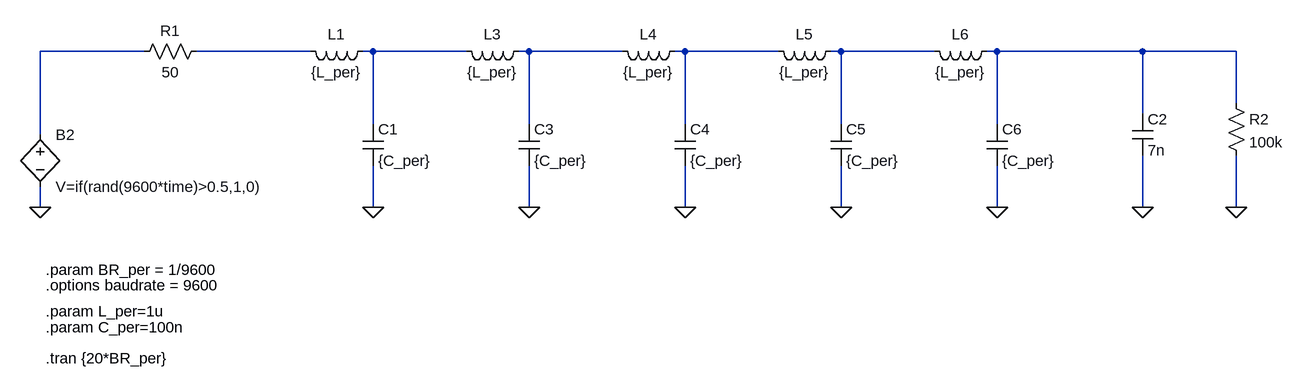
[diagram p0: schematic tline.asc]
tline.asc, the LTspice schematic file:
Version 4
SHEET 1 1784 680
WIRE 32 64 -128 64
WIRE 288 64 112 64
WIRE 384 64 368 64
WIRE 528 64 384 64
WIRE 624 64 608 64
WIRE 768 64 624 64
WIRE 864 64 848 64
WIRE 1008 64 864 64
WIRE 1104 64 1088 64
WIRE 1248 64 1104 64
WIRE 1344 64 1328 64
WIRE 1568 64 1344 64
WIRE 1712 64 1568 64
WIRE 1712 144 1712 64
WIRE 1568 160 1568 64
WIRE 384 176 384 64
WIRE 624 176 624 64
WIRE 864 176 864 64
WIRE 1104 176 1104 64
WIRE 1344 176 1344 64
WIRE -128 192 -128 64
WIRE -128 304 -128 272
WIRE 384 304 384 240
WIRE 624 304 624 240
WIRE 864 304 864 240
WIRE 1104 304 1104 240
WIRE 1344 304 1344 240
WIRE 1568 304 1568 224
WIRE 1712 304 1712 224
FLAG -128 304 0
FLAG 384 304 0
FLAG 624 304 0
FLAG 864 304 0
FLAG 1104 304 0
FLAG 1344 304 0
FLAG 1568 304 0
FLAG 1712 304 0
SYMBOL ind 384 48 R90
WINDOW 0 5 56 VBottom 2
WINDOW 3 32 56 VTop 2
SYMATTR InstName L1
SYMATTR Value {L_per}
SYMBOL cap 368 176 R0
SYMATTR InstName C1
SYMATTR Value {C_per}
SYMBOL ind 624 48 R90
WINDOW 0 5 56 VBottom 2
WINDOW 3 32 56 VTop 2
SYMATTR InstName L3
SYMATTR Value {L_per}
SYMBOL cap 608 176 R0
SYMATTR InstName C3
SYMATTR Value {C_per}
SYMBOL ind 864 48 R90
WINDOW 0 5 56 VBottom 2
WINDOW 3 32 56 VTop 2
SYMATTR InstName L4
SYMATTR Value {L_per}
SYMBOL cap 848 176 R0
SYMATTR InstName C4
SYMATTR Value {C_per}
SYMBOL ind 1104 48 R90
WINDOW 0 5 56 VBottom 2
WINDOW 3 32 56 VTop 2
SYMATTR InstName L5
SYMATTR Value {L_per}
SYMBOL cap 1088 176 R0
SYMATTR InstName C5
SYMATTR Value {C_per}
SYMBOL ind 1344 48 R90
WINDOW 0 5 56 VBottom 2
WINDOW 3 32 56 VTop 2
SYMATTR InstName L6
SYMATTR Value {L_per}
SYMBOL cap 1328 176 R0
SYMATTR InstName C6
SYMATTR Value {C_per}
SYMBOL res 128 48 R90
WINDOW 0 0 56 VBottom 2
WINDOW 3 32 56 VTop 2
SYMATTR InstName R1
SYMATTR Value 50
SYMBOL cap 1552 160 R0
SYMATTR InstName C2
SYMATTR Value 7n
SYMBOL res 1696 128 R0
SYMATTR InstName R2
SYMATTR Value 100k
SYMBOL bv -128 176 R0
SYMATTR InstName B2
SYMATTR Value V=if(rand(9600*time)>0.5,1,0)
TEXT -120 400 Left 2 !.param BR_per = 1/9600
TEXT -120 464 Left 2 !.param L_per=1u
TEXT -120 488 Left 2 !.param C_per=100n
TEXT -120 536 Left 2 !.tran {20*BR_per}
TEXT -120 424 Left 2 !.options baudrate = 9600

The netlist it stands for:
* tline.asc
L1 N003 N002 {L_per}
C1 N003 0 {C_per}
L3 N004 N003 {L_per}
C3 N004 0 {C_per}
L4 N005 N004 {L_per}
C4 N005 0 {C_per}
L5 N006 N005 {L_per}
C5 N006 0 {C_per}
L6 N007 N006 {L_per}
C6 N007 0 {C_per}
R1 N002 N001 50
C2 N007 0 7n
R2 N007 0 100k
B2 N001 0 V=if(rand(9600*time)>0.5,1,0)
.param BR_per = 1/9600
.param L_per=1u
.param C_per=100n
.tran {20*BR_per}
.options baudrate = 9600
.backanno
.end